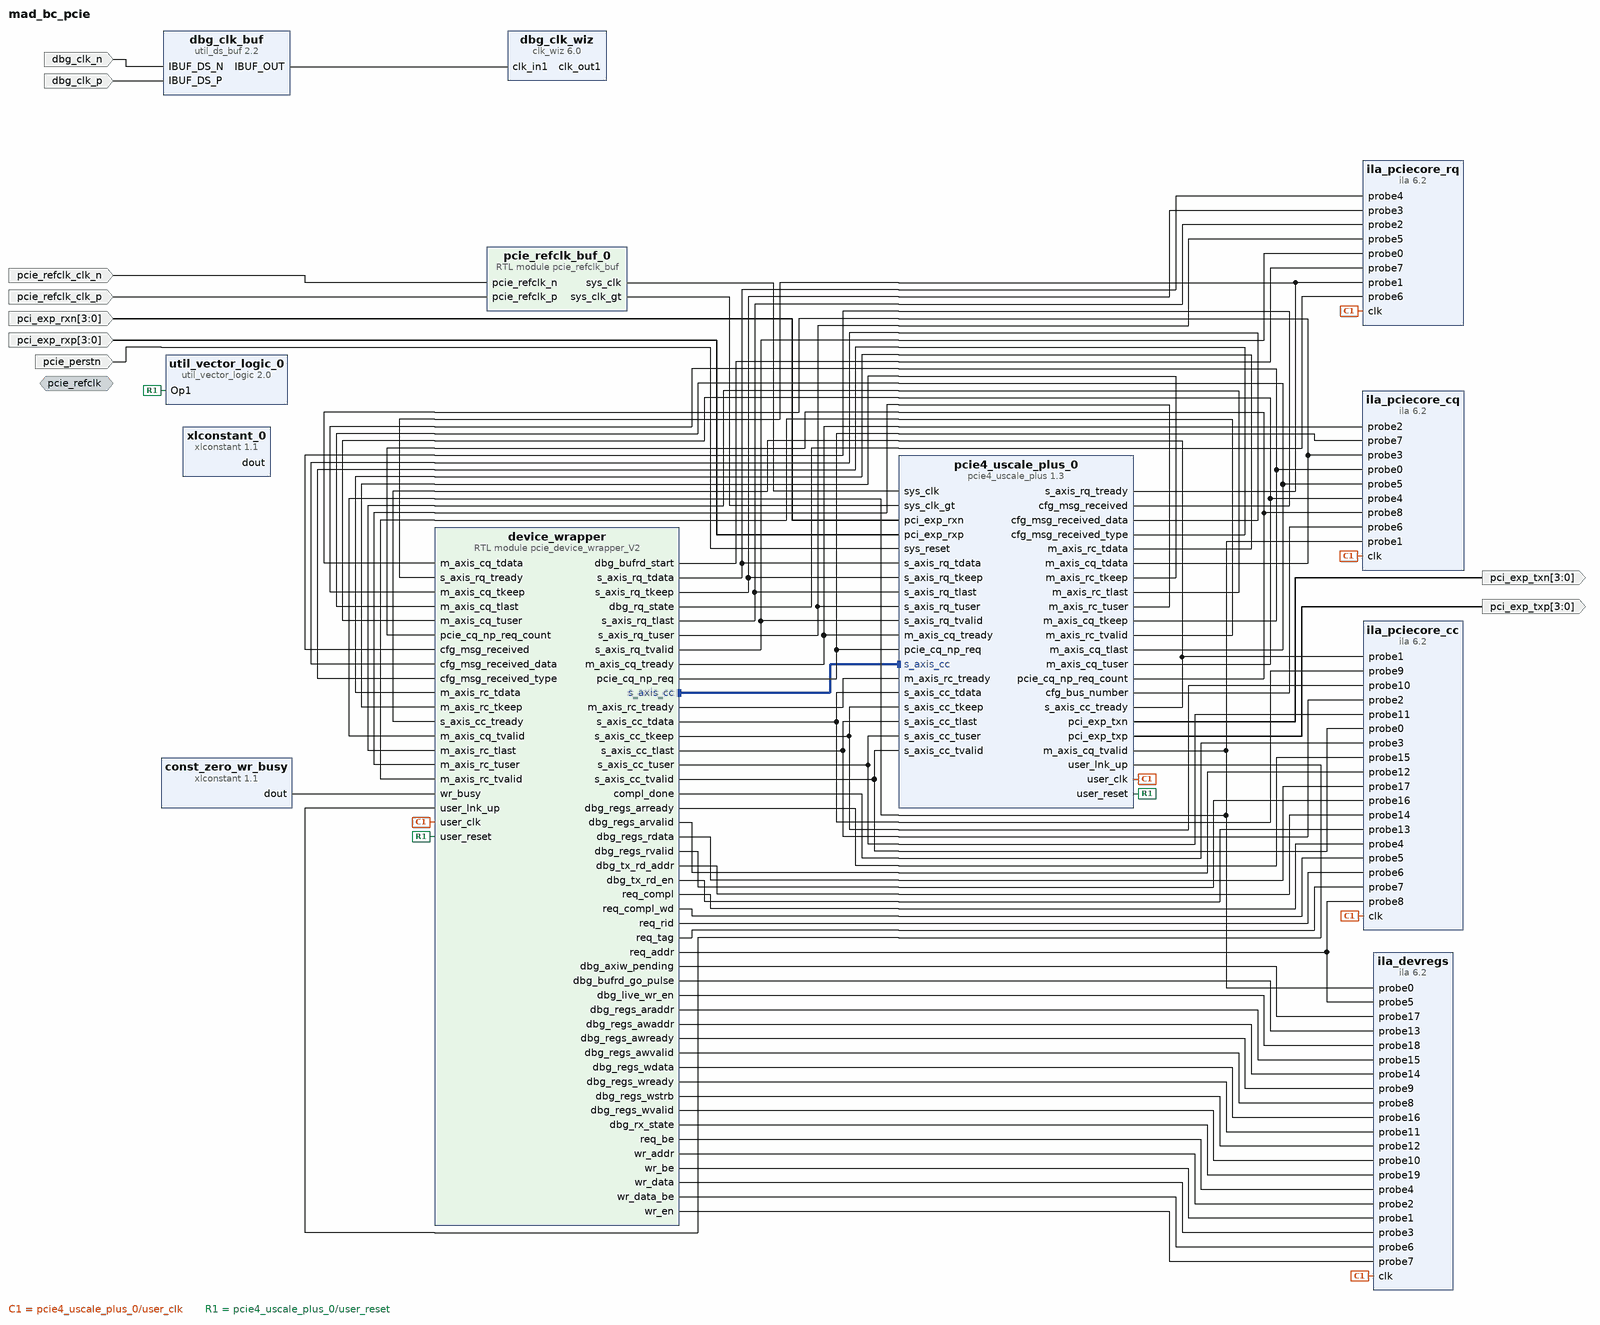
[diagram p0: block diagram of the top level]
# Vivado block design mad_bc_pcie, xcku5p-ffvb676-2-e, Vivado 2023.2
create_bd_design mad_bc_pcie

create_bd_intf_port -mode Slave -vlnv xilinx.com:interface:diff_clock_rtl:1.0 pcie_refclk
set_property -dict {CONFIG.FREQ_HZ 100000000} [get_bd_intf_ports pcie_refclk]
create_bd_port -dir I -type clk pcie_refclk_clk_p
set_property -dict {CONFIG.FREQ_HZ 100000000} [get_bd_ports pcie_refclk_clk_p]
create_bd_port -dir I -type clk pcie_refclk_clk_n
set_property -dict {CONFIG.FREQ_HZ 100000000} [get_bd_ports pcie_refclk_clk_n]
create_bd_port -dir I -type rst pcie_perstn
set_property -dict {CONFIG.POLARITY ACTIVE_LOW} [get_bd_ports pcie_perstn]
create_bd_port -dir I -from 3 -to 0 pci_exp_rxp
create_bd_port -dir I -from 3 -to 0 pci_exp_rxn
create_bd_port -dir O -from 3 -to 0 pci_exp_txp
create_bd_port -dir O -from 3 -to 0 pci_exp_txn
create_bd_port -dir I -type clk dbg_clk_p
set_property -dict {CONFIG.FREQ_HZ 300000000} [get_bd_ports dbg_clk_p]
create_bd_port -dir I -type clk dbg_clk_n
set_property -dict {CONFIG.FREQ_HZ 300000000} [get_bd_ports dbg_clk_n]

create_bd_cell -type module -reference pcie_refclk_buf pcie_refclk_buf_0
create_bd_cell -type ip -vlnv xilinx.com:ip:util_vector_logic:2.0 util_vector_logic_0
set_property -dict {CONFIG.C_OPERATION not CONFIG.C_SIZE 1} [get_bd_cells util_vector_logic_0]
create_bd_cell -type ip -vlnv xilinx.com:ip:pcie4_uscale_plus:1.3 pcie4_uscale_plus_0
set_property -dict [list \
  CONFIG.PCIE_BOARD_INTERFACE Custom \
  CONFIG.PF0_DEVICE_ID 1001 \
  CONFIG.PF0_REVISION_ID 01 \
  CONFIG.PF0_SUBSYSTEM_ID 1001 \
  CONFIG.PF0_SUBSYSTEM_VENDOR_ID 9808 \
  CONFIG.PF0_Use_Class_Code_Lookup_Assistant true \
  CONFIG.PL_LINK_CAP_MAX_LINK_SPEED 8.0_GT/s \
  CONFIG.PL_LINK_CAP_MAX_LINK_WIDTH X4 \
  CONFIG.SYS_RST_N_BOARD_INTERFACE Custom \
  CONFIG.bmd_pio_mode false \
  CONFIG.completer_model true \
  CONFIG.dedicate_perst true \
  CONFIG.en_gt_selection true \
  CONFIG.mode_selection Basic \
  CONFIG.pf0_bar0_64bit true \
  CONFIG.pf0_bar0_enabled true \
  CONFIG.pf0_bar0_prefetchable false \
  CONFIG.pf0_bar0_size 16 \
  CONFIG.pf0_bar2_64bit true \
  CONFIG.pf0_bar2_enabled true \
  CONFIG.pf0_bar2_prefetchable false \
  CONFIG.pf0_bar2_size 4 \
  CONFIG.pf0_bar4_64bit true \
  CONFIG.pf0_bar4_enabled true \
  CONFIG.pf0_bar4_prefetchable false \
  CONFIG.pf0_bar4_scale Megabytes \
  CONFIG.pf0_bar4_size 2 \
  CONFIG.select_quad GTY_Quad_224 \
  CONFIG.sys_reset_polarity ACTIVE_LOW \
  CONFIG.use_standard_interfaces false \
  CONFIG.user_interface_signals false \
  CONFIG.vendor_id 9808 \
] [get_bd_cells pcie4_uscale_plus_0]
create_bd_cell -type ip -vlnv xilinx.com:ip:util_ds_buf:2.2 dbg_clk_buf
set_property -dict {CONFIG.C_BUF_TYPE IBUFDS} [get_bd_cells dbg_clk_buf]
create_bd_cell -type ip -vlnv xilinx.com:ip:clk_wiz:6.0 dbg_clk_wiz
set_property -dict [list \
  CONFIG.CLKOUT1_DRIVES Buffer \
  CONFIG.CLKOUT1_REQUESTED_OUT_FREQ 100.000 \
  CONFIG.CLKOUT2_DRIVES Buffer \
  CONFIG.CLKOUT3_DRIVES Buffer \
  CONFIG.CLKOUT4_DRIVES Buffer \
  CONFIG.CLKOUT5_DRIVES Buffer \
  CONFIG.CLKOUT6_DRIVES Buffer \
  CONFIG.CLKOUT7_DRIVES Buffer \
  CONFIG.FEEDBACK_SOURCE FDBK_AUTO \
  CONFIG.NUM_OUT_CLKS 1 \
  CONFIG.PRIM_IN_FREQ 300.000 \
  CONFIG.USE_LOCKED false \
  CONFIG.USE_RESET false \
  CONFIG.USE_SAFE_CLOCK_STARTUP false \
] [get_bd_cells dbg_clk_wiz]
create_bd_cell -type ip -vlnv xilinx.com:ip:xlconstant:1.1 xlconstant_0
create_bd_cell -type ip -vlnv xilinx.com:ip:xlconstant:1.1 const_zero_wr_busy
set_property -dict {CONFIG.CONST_VAL 0} [get_bd_cells const_zero_wr_busy]
create_bd_cell -type ip -vlnv xilinx.com:ip:ila:6.2 ila_pciecore_cq
set_property -dict [list \
  CONFIG.C_MONITOR_TYPE Native \
  CONFIG.C_NUM_OF_PROBES 9 \
  CONFIG.C_PROBE0_WIDTH 4 \
  CONFIG.C_PROBE3_WIDTH 128 \
  CONFIG.C_PROBE4_WIDTH 88 \
  CONFIG.C_PROBE6_WIDTH 8 \
  CONFIG.C_PROBE7_WIDTH 2 \
  CONFIG.C_PROBE8_WIDTH 6 \
] [get_bd_cells ila_pciecore_cq]
create_bd_cell -type module -reference pcie_device_wrapper_V2 device_wrapper
create_bd_cell -type ip -vlnv xilinx.com:ip:ila:6.2 ila_devregs
set_property -dict [list \
  CONFIG.C_MONITOR_TYPE Native \
  CONFIG.C_NUM_OF_PROBES 20 \
  CONFIG.C_PROBE12_WIDTH 4 \
  CONFIG.C_PROBE14_WIDTH 16 \
  CONFIG.C_PROBE15_WIDTH 16 \
  CONFIG.C_PROBE16_WIDTH 32 \
  CONFIG.C_PROBE19_WIDTH 8 \
  CONFIG.C_PROBE1_WIDTH 8 \
  CONFIG.C_PROBE2_WIDTH 11 \
  CONFIG.C_PROBE3_WIDTH 512 \
  CONFIG.C_PROBE4_WIDTH 8 \
  CONFIG.C_PROBE5_WIDTH 13 \
  CONFIG.C_PROBE6_WIDTH 64 \
] [get_bd_cells ila_devregs]
create_bd_cell -type ip -vlnv xilinx.com:ip:ila:6.2 ila_pciecore_cc
set_property -dict [list \
  CONFIG.C_MONITOR_TYPE Native \
  CONFIG.C_NUM_OF_PROBES 18 \
  CONFIG.C_PROBE10_WIDTH 4 \
  CONFIG.C_PROBE11_WIDTH 33 \
  CONFIG.C_PROBE14_WIDTH 5 \
  CONFIG.C_PROBE17_WIDTH 32 \
  CONFIG.C_PROBE6_WIDTH 16 \
  CONFIG.C_PROBE7_WIDTH 8 \
  CONFIG.C_PROBE8_WIDTH 13 \
  CONFIG.C_PROBE9_WIDTH 128 \
] [get_bd_cells ila_pciecore_cc]
create_bd_cell -type ip -vlnv xilinx.com:ip:ila:6.2 ila_pciecore_rq
set_property -dict [list \
  CONFIG.C_MONITOR_TYPE Native \
  CONFIG.C_NUM_OF_PROBES 8 \
  CONFIG.C_PROBE3_WIDTH 4 \
  CONFIG.C_PROBE4_WIDTH 128 \
  CONFIG.C_PROBE5_WIDTH 62 \
  CONFIG.C_PROBE6_WIDTH 8 \
] [get_bd_cells ila_pciecore_rq]

# ---- connections ----

connect_bd_intf_net [get_bd_intf_pins pcie4_uscale_plus_0/s_axis_cc] [get_bd_intf_pins device_wrapper/s_axis_cc]
connect_bd_net [get_bd_pins const_zero_wr_busy/dout] [get_bd_pins device_wrapper/wr_busy]
connect_bd_net [get_bd_pins dbg_clk_buf/IBUF_OUT] [get_bd_pins dbg_clk_wiz/clk_in1]
connect_bd_net [get_bd_ports dbg_clk_n] [get_bd_pins dbg_clk_buf/IBUF_DS_N]
connect_bd_net [get_bd_ports dbg_clk_p] [get_bd_pins dbg_clk_buf/IBUF_DS_P]
# net dbg_clk_wiz_clk_out1 has one end: dbg_clk_wiz/clk_out1
connect_bd_net [get_bd_pins device_wrapper/compl_done] [get_bd_pins ila_pciecore_cc/probe3]
connect_bd_net [get_bd_pins device_wrapper/dbg_axiw_pending] [get_bd_pins ila_devregs/probe17]
connect_bd_net [get_bd_pins device_wrapper/dbg_bufrd_go_pulse] [get_bd_pins ila_devregs/probe13]
connect_bd_net -net device_wrapper_dbg_bufrd_input_start [get_bd_pins device_wrapper/dbg_bufrd_start] [get_bd_pins ila_pciecore_rq/probe7]
connect_bd_net [get_bd_pins device_wrapper/dbg_live_wr_en] [get_bd_pins ila_devregs/probe18]
connect_bd_net [get_bd_pins device_wrapper/dbg_regs_araddr] [get_bd_pins ila_devregs/probe15]
connect_bd_net [get_bd_pins device_wrapper/dbg_regs_arready] [get_bd_pins ila_pciecore_cc/probe15]
connect_bd_net [get_bd_pins device_wrapper/dbg_regs_arvalid] [get_bd_pins ila_pciecore_cc/probe12]
connect_bd_net [get_bd_pins device_wrapper/dbg_regs_awaddr] [get_bd_pins ila_devregs/probe14]
connect_bd_net [get_bd_pins device_wrapper/dbg_regs_awready] [get_bd_pins ila_devregs/probe9]
connect_bd_net [get_bd_pins device_wrapper/dbg_regs_awvalid] [get_bd_pins ila_devregs/probe8]
connect_bd_net [get_bd_pins device_wrapper/dbg_regs_rdata] [get_bd_pins ila_pciecore_cc/probe17]
connect_bd_net [get_bd_pins device_wrapper/dbg_regs_rvalid] [get_bd_pins ila_pciecore_cc/probe16]
connect_bd_net [get_bd_pins device_wrapper/dbg_regs_wdata] [get_bd_pins ila_devregs/probe16]
connect_bd_net [get_bd_pins device_wrapper/dbg_regs_wready] [get_bd_pins ila_devregs/probe11]
connect_bd_net [get_bd_pins device_wrapper/dbg_regs_wstrb] [get_bd_pins ila_devregs/probe12]
connect_bd_net [get_bd_pins device_wrapper/dbg_regs_wvalid] [get_bd_pins ila_devregs/probe10]
connect_bd_net [get_bd_pins device_wrapper/dbg_rq_state] [get_bd_pins ila_pciecore_rq/probe6]
connect_bd_net [get_bd_pins device_wrapper/dbg_rx_state] [get_bd_pins ila_devregs/probe19]
connect_bd_net [get_bd_pins device_wrapper/dbg_tx_rd_addr] [get_bd_pins ila_pciecore_cc/probe14]
connect_bd_net [get_bd_pins device_wrapper/dbg_tx_rd_en] [get_bd_pins ila_pciecore_cc/probe13]
connect_bd_net [get_bd_pins device_wrapper/m_axis_rc_tready] [get_bd_pins pcie4_uscale_plus_0/m_axis_rc_tready]
connect_bd_net [get_bd_pins device_wrapper/req_addr] [get_bd_pins ila_devregs/probe5] [get_bd_pins ila_pciecore_cc/probe8]
connect_bd_net [get_bd_pins device_wrapper/req_be] [get_bd_pins ila_devregs/probe4]
connect_bd_net [get_bd_pins device_wrapper/req_compl] [get_bd_pins ila_pciecore_cc/probe4]
connect_bd_net [get_bd_pins device_wrapper/req_compl_wd] [get_bd_pins ila_pciecore_cc/probe5]
connect_bd_net [get_bd_pins device_wrapper/req_rid] [get_bd_pins ila_pciecore_cc/probe6]
connect_bd_net [get_bd_pins device_wrapper/req_tag] [get_bd_pins ila_pciecore_cc/probe7]
connect_bd_net [get_bd_pins device_wrapper/s_axis_cc_tdata] [get_bd_pins pcie4_uscale_plus_0/s_axis_cc_tdata] [get_bd_pins ila_pciecore_cc/probe9]
connect_bd_net [get_bd_pins device_wrapper/s_axis_cc_tkeep] [get_bd_pins pcie4_uscale_plus_0/s_axis_cc_tkeep] [get_bd_pins ila_pciecore_cc/probe10]
connect_bd_net [get_bd_pins device_wrapper/s_axis_cc_tlast] [get_bd_pins pcie4_uscale_plus_0/s_axis_cc_tlast] [get_bd_pins ila_pciecore_cc/probe2]
connect_bd_net [get_bd_pins device_wrapper/s_axis_cc_tuser] [get_bd_pins pcie4_uscale_plus_0/s_axis_cc_tuser] [get_bd_pins ila_pciecore_cc/probe11]
connect_bd_net [get_bd_pins device_wrapper/s_axis_cc_tvalid] [get_bd_pins pcie4_uscale_plus_0/s_axis_cc_tvalid] [get_bd_pins ila_pciecore_cc/probe0]
connect_bd_net [get_bd_pins device_wrapper/s_axis_rq_tdata] [get_bd_pins pcie4_uscale_plus_0/s_axis_rq_tdata] [get_bd_pins ila_pciecore_rq/probe4]
connect_bd_net [get_bd_pins device_wrapper/s_axis_rq_tkeep] [get_bd_pins pcie4_uscale_plus_0/s_axis_rq_tkeep] [get_bd_pins ila_pciecore_rq/probe3]
connect_bd_net [get_bd_pins device_wrapper/s_axis_rq_tlast] [get_bd_pins pcie4_uscale_plus_0/s_axis_rq_tlast] [get_bd_pins ila_pciecore_rq/probe2]
connect_bd_net [get_bd_pins device_wrapper/s_axis_rq_tuser] [get_bd_pins pcie4_uscale_plus_0/s_axis_rq_tuser] [get_bd_pins ila_pciecore_rq/probe5]
connect_bd_net [get_bd_pins device_wrapper/s_axis_rq_tvalid] [get_bd_pins pcie4_uscale_plus_0/s_axis_rq_tvalid] [get_bd_pins ila_pciecore_rq/probe0]
connect_bd_net [get_bd_pins device_wrapper/wr_addr] [get_bd_pins ila_devregs/probe2]
connect_bd_net [get_bd_pins device_wrapper/wr_be] [get_bd_pins ila_devregs/probe1]
connect_bd_net [get_bd_pins device_wrapper/wr_data] [get_bd_pins ila_devregs/probe3]
connect_bd_net [get_bd_pins device_wrapper/wr_data_be] [get_bd_pins ila_devregs/probe6]
connect_bd_net [get_bd_pins device_wrapper/wr_en] [get_bd_pins ila_devregs/probe7]
connect_bd_net -net pci_exp_rxn_0_2 [get_bd_ports pci_exp_rxn] [get_bd_pins pcie4_uscale_plus_0/pci_exp_rxn]
connect_bd_net -net pci_exp_rxp_0_2 [get_bd_ports pci_exp_rxp] [get_bd_pins pcie4_uscale_plus_0/pci_exp_rxp]
connect_bd_net [get_bd_pins pcie4_uscale_plus_0/cfg_bus_number] [get_bd_pins ila_pciecore_cq/probe6]
connect_bd_net [get_bd_pins pcie4_uscale_plus_0/cfg_msg_received] [get_bd_pins device_wrapper/cfg_msg_received]
connect_bd_net [get_bd_pins pcie4_uscale_plus_0/cfg_msg_received_data] [get_bd_pins device_wrapper/cfg_msg_received_data]
connect_bd_net [get_bd_pins pcie4_uscale_plus_0/cfg_msg_received_type] [get_bd_pins device_wrapper/cfg_msg_received_type]
connect_bd_net [get_bd_pins pcie4_uscale_plus_0/m_axis_cq_tdata] [get_bd_pins ila_pciecore_cq/probe3] [get_bd_pins device_wrapper/m_axis_cq_tdata]
connect_bd_net [get_bd_pins pcie4_uscale_plus_0/m_axis_cq_tkeep] [get_bd_pins ila_pciecore_cq/probe0] [get_bd_pins device_wrapper/m_axis_cq_tkeep]
connect_bd_net [get_bd_pins pcie4_uscale_plus_0/m_axis_cq_tlast] [get_bd_pins ila_pciecore_cq/probe5] [get_bd_pins device_wrapper/m_axis_cq_tlast]
connect_bd_net [get_bd_pins pcie4_uscale_plus_0/m_axis_cq_tuser] [get_bd_pins ila_pciecore_cq/probe4] [get_bd_pins device_wrapper/m_axis_cq_tuser]
connect_bd_net [get_bd_pins pcie4_uscale_plus_0/m_axis_cq_tvalid] \
  [get_bd_pins ila_pciecore_cq/probe1] [get_bd_pins ila_devregs/probe0] [get_bd_pins device_wrapper/m_axis_cq_tvalid]
connect_bd_net [get_bd_pins pcie4_uscale_plus_0/m_axis_rc_tdata] [get_bd_pins device_wrapper/m_axis_rc_tdata]
connect_bd_net [get_bd_pins pcie4_uscale_plus_0/m_axis_rc_tkeep] [get_bd_pins device_wrapper/m_axis_rc_tkeep]
connect_bd_net [get_bd_pins pcie4_uscale_plus_0/m_axis_rc_tlast] [get_bd_pins device_wrapper/m_axis_rc_tlast]
connect_bd_net [get_bd_pins pcie4_uscale_plus_0/m_axis_rc_tuser] [get_bd_pins device_wrapper/m_axis_rc_tuser]
connect_bd_net [get_bd_pins pcie4_uscale_plus_0/m_axis_rc_tvalid] [get_bd_pins device_wrapper/m_axis_rc_tvalid]
connect_bd_net [get_bd_pins pcie4_uscale_plus_0/pci_exp_txn] [get_bd_ports pci_exp_txn]
connect_bd_net [get_bd_pins pcie4_uscale_plus_0/pci_exp_txp] [get_bd_ports pci_exp_txp]
connect_bd_net [get_bd_pins pcie4_uscale_plus_0/pcie_cq_np_req_count] \
  [get_bd_pins ila_pciecore_cq/probe8] [get_bd_pins device_wrapper/pcie_cq_np_req_count]
connect_bd_net [get_bd_pins pcie4_uscale_plus_0/s_axis_cc_tready] [get_bd_pins ila_pciecore_cc/probe1] [get_bd_pins device_wrapper/s_axis_cc_tready]
connect_bd_net [get_bd_pins pcie4_uscale_plus_0/s_axis_rq_tready] [get_bd_pins ila_pciecore_rq/probe1] [get_bd_pins device_wrapper/s_axis_rq_tready]
connect_bd_net [get_bd_pins pcie4_uscale_plus_0/user_clk] \
  [get_bd_pins ila_pciecore_cq/clk] [get_bd_pins ila_devregs/clk] [get_bd_pins ila_pciecore_cc/clk] \
  [get_bd_pins ila_pciecore_rq/clk] [get_bd_pins device_wrapper/user_clk]
connect_bd_net [get_bd_pins pcie4_uscale_plus_0/user_lnk_up] [get_bd_pins device_wrapper/user_lnk_up]
connect_bd_net [get_bd_pins pcie4_uscale_plus_0/user_reset] [get_bd_pins util_vector_logic_0/Op1] [get_bd_pins device_wrapper/user_reset]
connect_bd_net -net pcie_device_wrapper_0_m_axis_cq_tready [get_bd_pins device_wrapper/m_axis_cq_tready] \
  [get_bd_pins pcie4_uscale_plus_0/m_axis_cq_tready] [get_bd_pins ila_pciecore_cq/probe2]
connect_bd_net -net pcie_device_wrapper_0_pcie_cq_np_req1 [get_bd_pins device_wrapper/pcie_cq_np_req] \
  [get_bd_pins pcie4_uscale_plus_0/pcie_cq_np_req] [get_bd_pins ila_pciecore_cq/probe7]
connect_bd_net [get_bd_ports pcie_perstn] [get_bd_pins pcie4_uscale_plus_0/sys_reset]
connect_bd_net [get_bd_pins pcie_refclk_buf_0/sys_clk] [get_bd_pins pcie4_uscale_plus_0/sys_clk]
connect_bd_net [get_bd_pins pcie_refclk_buf_0/sys_clk_gt] [get_bd_pins pcie4_uscale_plus_0/sys_clk_gt]
connect_bd_net [get_bd_ports pcie_refclk_clk_n] [get_bd_pins pcie_refclk_buf_0/pcie_refclk_n]
connect_bd_net [get_bd_ports pcie_refclk_clk_p] [get_bd_pins pcie_refclk_buf_0/pcie_refclk_p]
# net xlconstant_0_dout has one end: xlconstant_0/dout

validate_bd_design
save_bd_design
